# EAGLE design Linear Amplifier Interface (EAGLE 7.7.0)
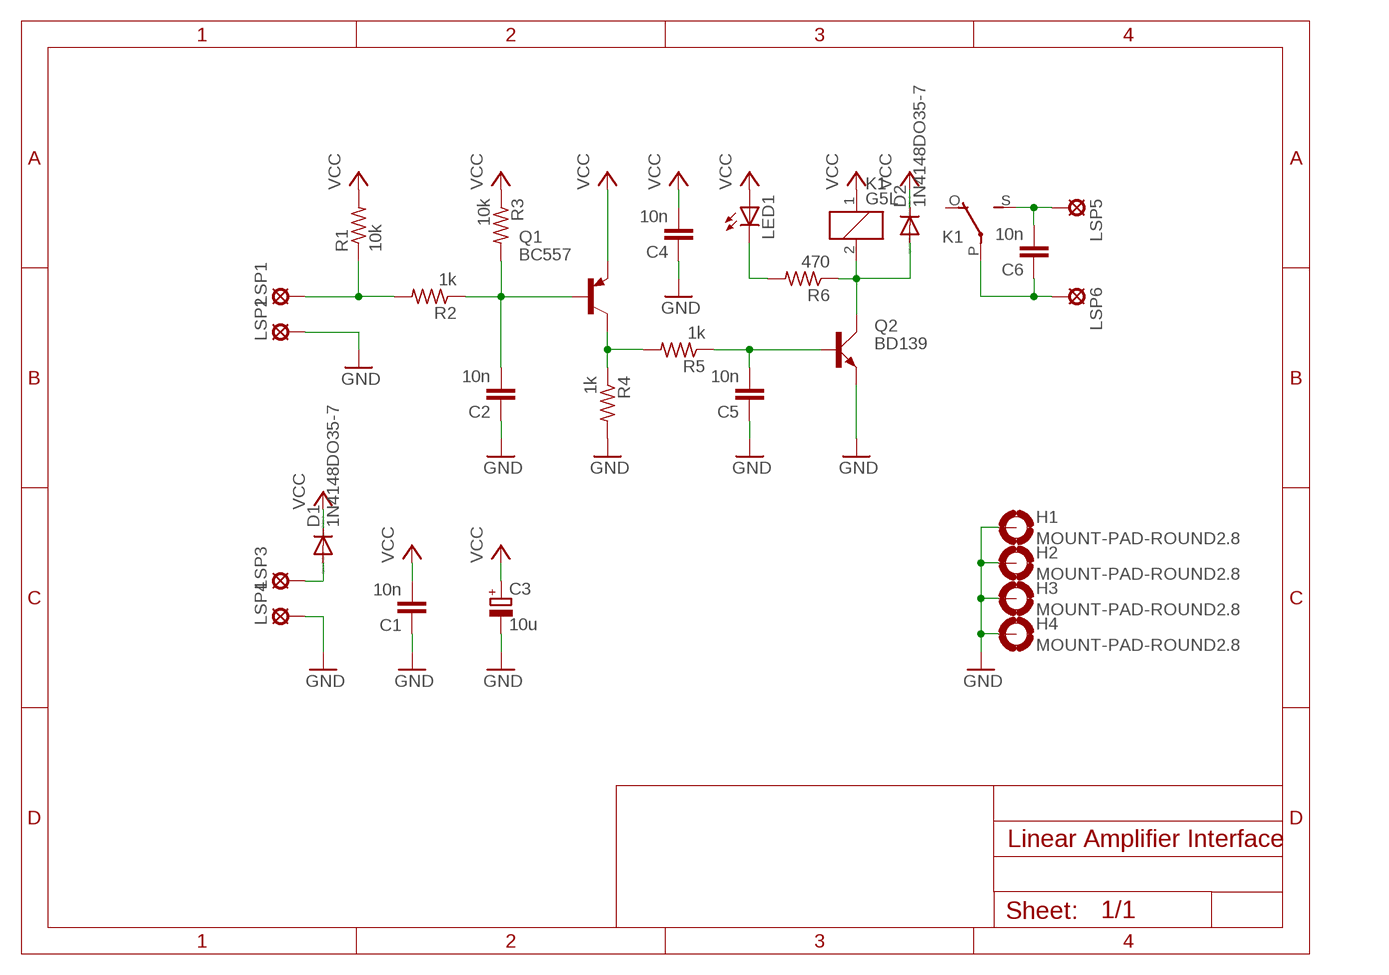
[diagram p0: schematic, sheet 1]

## Parts
C1  10n  C-EUC1206K  [C1206K]
C2  10n  C-EUC1206K  [C1206K]
C3  10u  CPOL-EUE5-6  [E5-6]
C4  10n  C-EUC1206K  [C1206K]
C5  10n  C-EUC1206K  [C1206K]
C6  10n  C-EUC1206K  [C1206K]
D1  1N4148DO35-7  [DO35-7]
D2  1N4148DO35-7  [DO35-7]
H1  MOUNT-PAD-ROUND2.8  [2,8-PAD]
H2  MOUNT-PAD-ROUND2.8  [2,8-PAD]
H3  MOUNT-PAD-ROUND2.8  [2,8-PAD]
H4  MOUNT-PAD-ROUND2.8  [2,8-PAD]
K1  G5L  [G5LE]
LED1  LED3MM  [LED3MM]
LSP1  SE11  [SE11]
LSP2  SE11  [SE11]
LSP3  SE11  [SE11]
LSP4  SE11  [SE11]
LSP5  SE11  [SE11]
LSP6  SE11  [SE11]
Q1  BC557  [TO92-EBC]
Q2  BD139  [TO126AV]
R1  10k  R-US_M1206  [M1206]
R2  1k  R-US_M1206  [M1206]
R3  10k  R-US_M1206  [M1206]
R4  1k  R-US_M1206  [M1206]
R5  1k  R-US_M1206  [M1206]
R6  470  R-US_M1206  [M1206]

## Nets
GND: C1.1 C2.1 C3.- C4.1 C5.1 H1.B2,8(MOUNT) H2.B2,8(MOUNT) H3.B2,8(MOUNT) H4.B2,8(MOUNT) LSP2.MP LSP4.MP Q2.E R4.2
N$1: C5.2 Q2.B R5.1
N$2: C2.2 Q1.B R2.1 R3.2
N$3: Q1.C R4.1 R5.2
N$4: LSP1.MP R1.1 R2.2
N$5: LED1.K(C) R6.2
N$6: D2.A K1.2 Q2.C R6.1
N$7: D1.A LSP3.MP
N$8: C6.2 K1.S(2:S) LSP5.MP
N$9: C6.1 K1.P(2:P) LSP6.MP
VCC: C1.2 C3.+ C4.2 D1.C D2.C K1.1 LED1.A Q1.E R1.2 R3.1
Unconnected: K1.O(2:O)

## Library data of the parts
C1 C2 C4-C6 = rcl:C-EU: CAPACITOR, European symbol
C3 = rcl:CPOL-EU: POLARIZED CAPACITOR, European symbol
D1 D2 = diode:1N4148: DIODE high speed (Philips)
H1-H4 = holes:MOUNT-PAD-ROUND: MOUNTING PAD, round
K1 = relay:G5L: RELAY 1 x switch, 10 A/120 V AC, 8 A/30 V ADC, Omron; OC_FARNELL: unknown; OC_NEWARK: unknown
LED1 = led:LED: LED OSRAM: - CHIPLED LG R971, LG N971, LY N971, LG Q971, LY Q971, LO R971, LY R971 LH N974, LH R974 LS Q976, LO Q976, LY Q976 LO Q996 - Hyper CHIPLED LW Q18S LB Q993, LB Q99A, LB R99A - SideLED LS A670, LO A670, LY A670, LG A670, LP A670 LB A673, LV A673, LT A673, LW A673 LH A674 LY A675 LS A676, LA A676, LO A676, LY A676, LW A676 LS A679, LY A679, LG A679 - Hyper Micro SIDELED® LS Y876, LA Y876, LO Y876, LY Y876 LT Y87S - SmartLED LW L88C, LW L88S LB L89C, LB L89S, LG L890 LS L89K, LO L89K, LY L89K LS L896, LA L896, LO L896, LY L896 - TOPLED LS T670, LO T670, LY T670, LG T670, LP T670 LSG T670, LSP T670, LSY T670, LOP T670, LYG T670 LG T671, LOG T671, LSG T671 LB T673, LV T673, LT T673, LW T673 LH T674 LS T676, LA T676, LO T676, LY T676, LB T676, LH T676, LSB T676, LW T676 LB T67C, LV T67C, LT T67C, LS T67K, LO T67K, LY T67K, LW E67C LS E67B, LA E67B, LO E67B, LY E67B, LB E67C, LV E67C, LT E67C LW T67C LS T679, LY T679, LG T679 LS T770, LO T770, LY T770, LG T770, LP T770 LB T773, LV T773, LT T773, LW T773 LH T774 LS E675, LA E675, LY E675, LS T675 LS T776, LA T776, LO T776, LY T776, LB T776 LHGB T686 LT T68C, LB T68C - Hyper Mini TOPLED® LB M676 - Mini TOPLED Santana® LG M470 LS M47K, LO M47K, LY M47K Source: http://www.osram.convergy.de LUXEON: - LUMILED® LXK2-PW12-R00, LXK2-PW12-S00, LXK2-PW14-U00, LXK2-PW14-V00 LXK2-PM12-R00, LXK2-PM12-S00, LXK2-PM14-U00 LXK2-PE12-Q00, LXK2-PE12-R00, LXK2-PE12-S00, LXK2-PE14-T00, LXK2-PE14-U00 LXK2-PB12-K00, LXK2-PB12-L00, LXK2-PB12-M00, LXK2-PB14-N00, LXK2-PB14-P00, LXK2-PB14-Q00 LXK2-PR12-L00, LXK2-PR12-M00, LXK2-PR14-Q00, LXK2-PR14-R00 LXK2-PD12-Q00, LXK2-PD12-R00, LXK2-PD12-S00 LXK2-PH12-R00, LXK2-PH12-S00 LXK2-PL12-P00, LXK2-PL12-Q00, LXK2-PL12-R00 Source: www.luxeon.com KINGBRIGHT: KA-3528ASYC Source: www.kingbright.com
LSP1-LSP6 = solpad:SE11: SOLDER PAD RTM, drill 1,1mm, distributor Buerklin, 07F810
Q1 = transistor-pnp:BC557*: PNP Transistror
Q2 = transistor-power:BD139: NPN TRANSISTOR
R1-R6 = rcl:R-US_: RESISTOR, American symbol

## Board
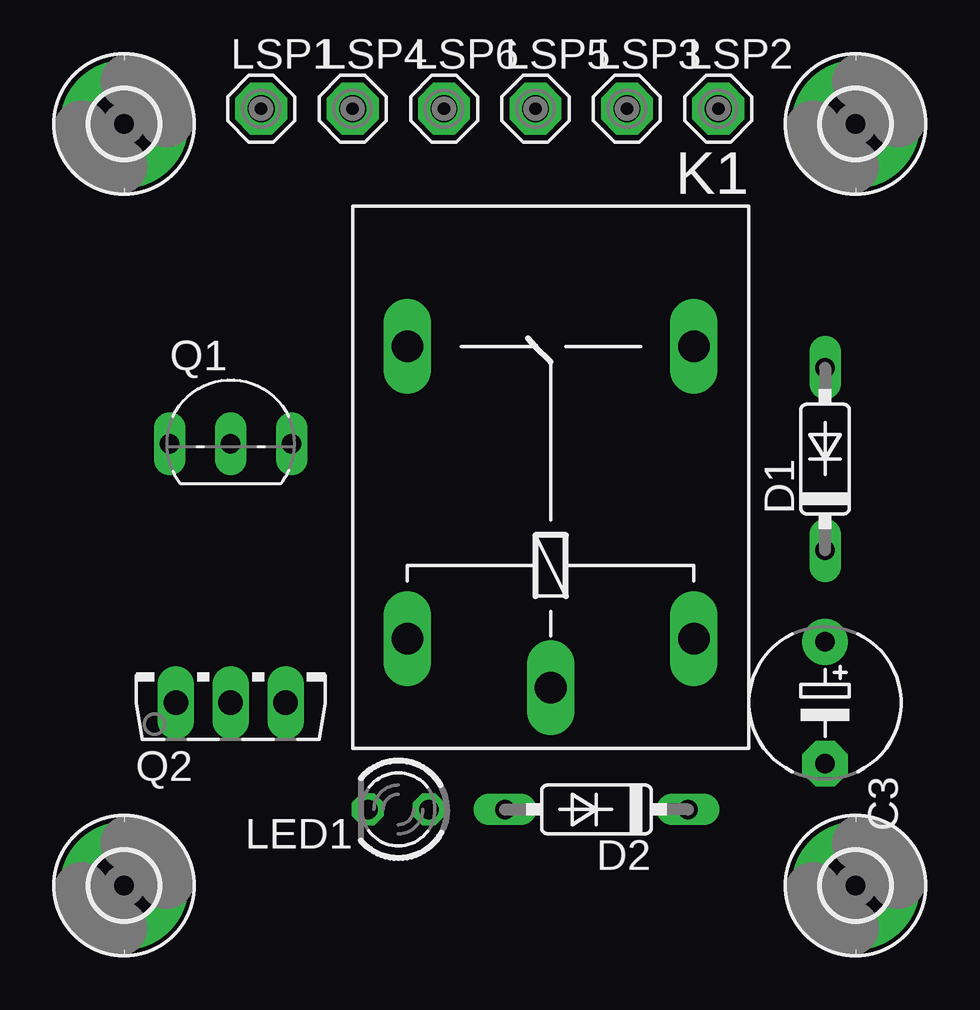
[diagram p1: board, top side]
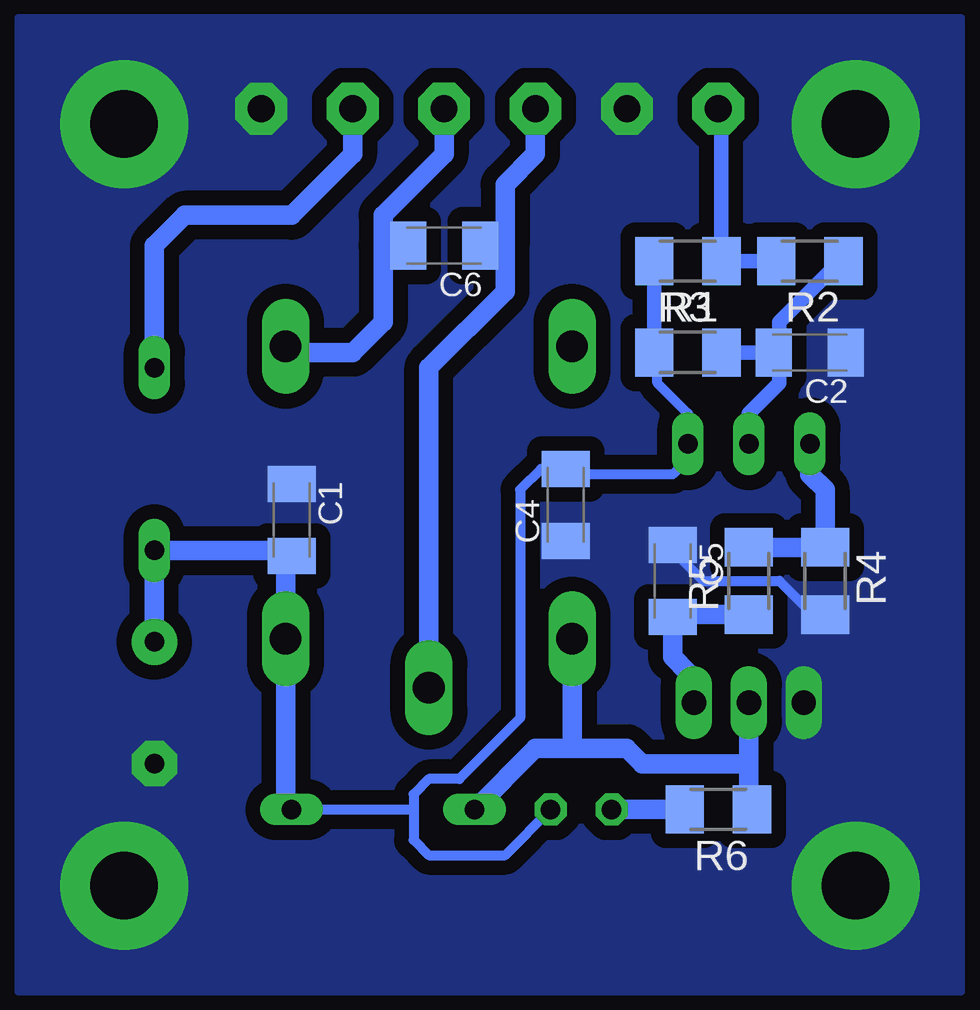
[diagram p2: board, bottom side, seen from below]

No outline drawn. Coordinates in mm, seen from the top.
Copper layers (1*16): Top 0.035mm / dielectric 1.5mm / Bottom 0.035mm
Design rules "default": minimum track width 10mil, minimum drill 24mil, track to track 8mil, track to pad 8mil, pad to pad 8mil, via to via 8mil, smd to smd 8mil, copper to edge 40mil, drill to drill 8mil, minimum pad ring 10mil, minimum via ring 8mil, stop-mask expansion 4mil, vias tented up to drill 0mil, thermal gap 10mil

### Footprints (pad centres in the part's own frame; a part is rotated, then mirrored left to right if it is on the bottom)
C1206K = smd 1.5 x 2: 1 -1.5,0; 2 1.5,0
E5-6 = drill 0.813 pad 1.905: + -2.54,0 | drill 0.813 pad 1.905 octagon: - 2.54,0
DO35-7 = drill 0.813 long: A 3.81,0; C -3.81,0
2,8-PAD = drill 2.8 pad 5.334: B2,8 0,0
G5LE = drill 1.321 long: 1 -7.493,-5.969; 2 -7.493,5.969; O 4.699,5.969; P -9.525,0; S 4.699,-5.969
LED3MM = drill 0.813 octagon: A -1.27,0; K 1.27,0
SE11 = drill 1.118 pad 2.159 octagon: MP 0,0
TO92-EBC = drill 0.813 long: B 0,-1.27; C -2.54,-1.27; E 2.54,-1.27
TO126AV = drill 1.016 long: B 2.286,-1.27; C 0,-1.27; E -2.286,-1.27
M1206 = smd 1.6 x 2: 1 -1.4,0; 2 1.4,0

### Placement (x,y rotation side)
C1  27.94,19.68 270 bottom
C2  6.35,26.67 180 bottom
C3  33.66,12.06 270 top
C4  16.51,20.32 90 bottom
C5  12.06,17.14 270 bottom
C6  21.59,31.11 180 bottom
D1  33.66,22.23 90 top
D2  24.13,7.62 180 top
H1  34.92,4.45 0 top
H2  4.45,4.45 0 top
H3  34.92,36.2 0 top
H4  4.45,36.2 0 top
K1  22.23,22.23 90 top
LED1  15.88,7.62 180 top
LSP1  10.16,36.83 0 top
LSP2  29.21,36.83 0 top
LSP3  25.4,36.83 0 top
LSP4  13.97,36.83 0 top
LSP5  21.59,36.83 0 top
LSP6  17.78,36.83 0 top
Q1  8.89,24.13 0 top
Q2  8.89,13.34 0 top
R1  11.43,30.48 180 bottom
R2  6.35,30.48 180 bottom
R3  11.43,26.67 0 bottom
R4  5.71,17.14 270 bottom
R5  8.89,17.14 90 bottom
R6  10.16,7.62 180 bottom

### Tracks (layer width: path | path; a pad name or v marks a point on that pad's centre or on a via)
GND
  Bottom 0.406: C5.1 12.06,18.41 10.79,17.14 7.62,17.14 6.35,15.88 5.84,15.88 R4.2
  pour Bottom (isolate 0.61, no thermals): 0,40.64 39.37,40.64 39.37,0 0,0
N$1
  Bottom 0.813: R5.1 11.96,15.74 C5.2 12.06,13.97 11.43,13.34 11.43,12.32 Q2.B
N$2
  Bottom 0.61: R2.1 5.08,30.48 7.62,27.94 7.62,26.9 C2.2 | R3.2 C2.2 | Q1.B 8.89,24.13 7.62,25.4 7.62,26.44 C2.2
N$3
  Bottom 0.813: R5.2 R4.1 5.71,20.95 6.35,21.59 Q1.C
N$4
  Bottom 0.61: LSP1.MP 10.03,36.7 R1.1 R2.2
N$5
  Bottom 0.813: R6.2 LED1.K
N$6
  Bottom 0.813: D2.A 17.78,10.16 16.51,10.16 | 16.51,10.16 13.97,10.16 13.34,9.53 8.89,9.53 | 8.89,9.53 8.89,7.75 R6.1 | Q2.C 8.89,9.53 | K1.2 16.26,10.41 16.51,10.16
N$7
  Bottom 0.813: LSP3.MP 25.4,34.92 27.94,32.38 32.38,32.38 33.66,31.11 D1.A
N$8
  Bottom 0.813: 24.13,31.11 24.13,27.94 25.4,26.67 27.94,26.67 K1.S | C6.2 24.13,31.11 | LSP5.MP 21.59,34.92 24.13,32.38 24.13,31.11
N$9
  Bottom 0.813: K1.P 22.23,26.04 19.05,29.21 19.05,31.11 | C6.1 19.05,31.11 | LSP6.MP 17.78,34.92 19.05,33.66 19.05,31.11
VCC
  Bottom 0.406: R3.1 12.7,26.54 12.7,25.4 11.43,24.13 Q1.E 11.43,22.23 12.06,21.59 16.28,21.59 C4.2 17.55,21.82 18.41,20.95 18.41,11.43 20.95,8.89 22.23,8.89 22.86,8.26 22.86,7.62 | 22.86,7.62 22.86,6.35 22.23,5.71 19.05,5.71 LED1.A | D2.C 22.86,7.62
  Bottom 0.61: R1.2 R3.1
  Bottom 0.813: D2.C 28.19,7.87 K1.1 28.19,17.93 C1.2 28.17,18.41 D1.C C3.+